# EAGLE design BBB-SPI-ADC-GPS-Cape (EAGLE 7.6.0)
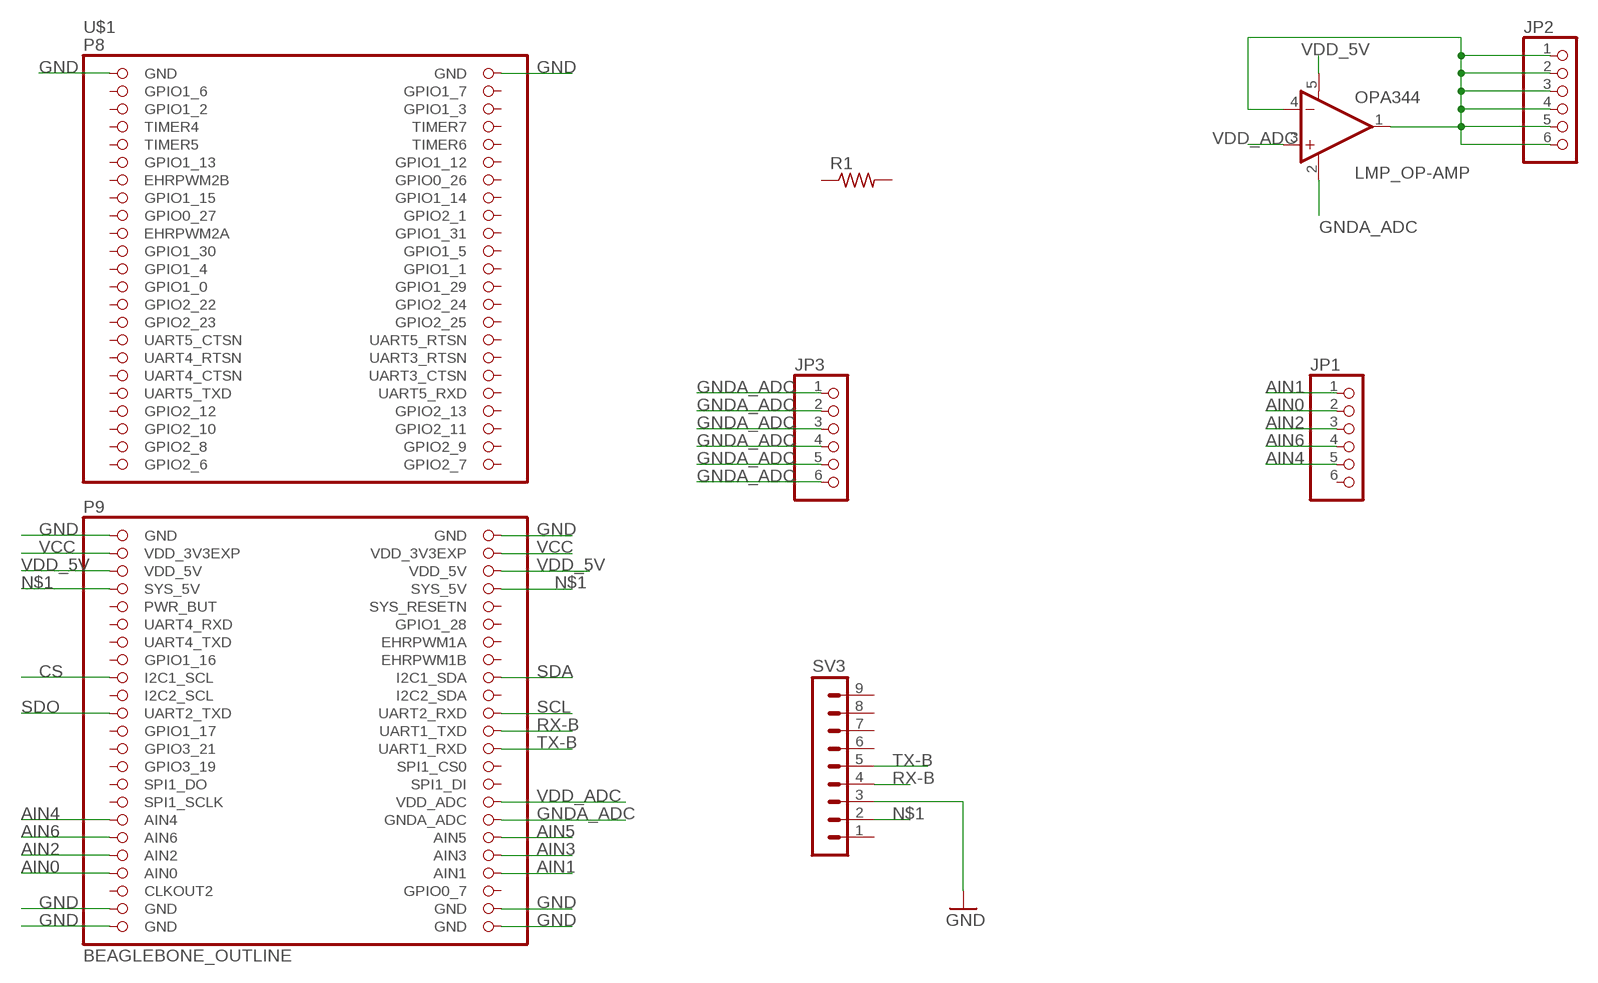
[diagram p0: schematic, sheet 1]

## Parts
JP1  PINHD-1X6  [1X06]
JP2  PINHD-1X6  [1X06]
JP3  PINHD-1X6  [1X06]
LMP_OP-AMP  OPA344  [SOT23-5]
R1  RES-US1206FAB  [R1206FAB]
SV3  MA09-1  [MA09-1]
U$1  BEAGLEBONE_OUTLINE  [BEAGLEBONE_SHIELD]

## Nets
AIN0: JP1.2 U$1.85(AIN0)
AIN1: JP1.1 U$1.86(AIN1)
AIN2: JP1.3 U$1.83(AIN2)
AIN3: U$1.84(AIN3)
AIN4: JP1.5 U$1.79(AIN4)
AIN5: U$1.82(AIN5)
AIN6: JP1.4 U$1.81(AIN6)
CS: U$1.63(I2C1_SCL)
GND: SV3.3 U$1.1(GND) U$1.2(GND) U$1.47(GND) U$1.48(GND) U$1.89(GND) U$1.90(GND) U$1.91(GND) U$1.92(GND)
GNDA_ADC: JP3.1 JP3.2 JP3.3 JP3.4 JP3.5 JP3.6 LMP_OP-AMP.2(V-) U$1.80(GNDA_ADC)
N$1: SV3.2 U$1.53(SYS_5V) U$1.54(SYS_5V)
N$2: JP2.1 JP2.2 JP2.3 JP2.4 JP2.5 JP2.6 LMP_OP-AMP.1(OUT) LMP_OP-AMP.4(-IN)
RX-B: SV3.4 U$1.70(UART1_TXD)
SCL: U$1.68(UART2_RXD)
SDA: U$1.64(I2C1_SDA)
SDO: U$1.67(UART2_TXD)
TX-B: SV3.5 U$1.72(UART1_RXD)
VCC: U$1.49(VDD_3V3EXP) U$1.50(VDD_3V3EXP)
VDD_5V: LMP_OP-AMP.5(V+) U$1.51(VDD_5V) U$1.52(VDD_5V)
VDD_ADC: LMP_OP-AMP.3(+IN) U$1.78(VDD_ADC)
Unconnected: JP1.6 R1.1 R1.2 SV3.1 SV3.6 SV3.7 SV3.8 SV3.9 U$1.3(GPIO1_6) U$1.4(GPIO1_7) U$1.5(GPIO1_2) U$1.6(GPIO1_3) U$1.7(TIMER4) U$1.8(TIMER7) U$1.9(TIMER5) U$1.10(TIMER6) U$1.11(GPIO1_13) U$1.12(GPIO1_12) U$1.13(EHRPWM2B) U$1.14(GPIO0_26) U$1.15(GPIO1_15) U$1.16(GPIO1_14) U$1.17(GPIO0_27) U$1.18(GPIO2_1) U$1.19(EHRPWM2A) U$1.20(GPIO1_31) U$1.21(GPIO1_30) U$1.22(GPIO1_5) U$1.23(GPIO1_4) U$1.24(GPIO1_1) U$1.25(GPIO1_0) U$1.26(GPIO1_29) U$1.27(GPIO2_22) U$1.28(GPIO2_24) U$1.29(GPIO2_23) U$1.30(GPIO2_25) U$1.31(UART5_CTSN) U$1.32(UART5_RTSN) U$1.33(UART4_RTSN) U$1.34(UART3_RTSN) U$1.35(UART4_CTSN) U$1.36(UART3_CTSN) U$1.37(UART5_TXD) U$1.38(UART5_RXD) U$1.39(GPIO2_12) U$1.40(GPIO2_13) U$1.41(GPIO2_10) U$1.42(GPIO2_11) U$1.43(GPIO2_8) U$1.44(GPIO2_9) U$1.45(GPIO2_6) U$1.46(GPIO2_7) U$1.55(PWR_BUT) U$1.56(SYS_RESETN) U$1.57(UART4_RXD) U$1.58(GPIO1_28) U$1.59(UART4_TXD) U$1.60(EHRPWM1A) U$1.61(GPIO1_16) U$1.62(EHRPWM1B) U$1.65(I2C2_SCL) U$1.66(I2C2_SDA) U$1.69(GPIO1_17) U$1.71(GPIO3_21) U$1.73(GPIO3_19) U$1.74(SPI1_CS0) U$1.75(SPI1_DO) U$1.76(SPI1_DI) U$1.77(SPI1_SCLK) U$1.87(CLKOUT2) U$1.88(GPIO0_7)

## Library data of the parts
JP1-JP3 = adafruit:PINHD-1X6: PIN HEADER
LMP_OP-AMP = SparkFun-AnalogIC:OPA344: Single gate rail-to-rail output op-amp. Inputs extend 300mV past rails.; PROD_ID: IC-08251
R1 = fab:RES-US: Resistor (US Symbol) Variants with postfix FAB are widened to allow the routing of internal traces
SV3 = con-lstb:MA09-1: PIN HEADER; OC_FARNELL: unknown; OC_NEWARK: unknown
U$1 = adafruit:BEAGLEBONE_OUTLINE: Should match A3 pinout - but not completely tested; OC_NEWARK: unknown

## Net classes
0 default: width 0.254 mm

## Board
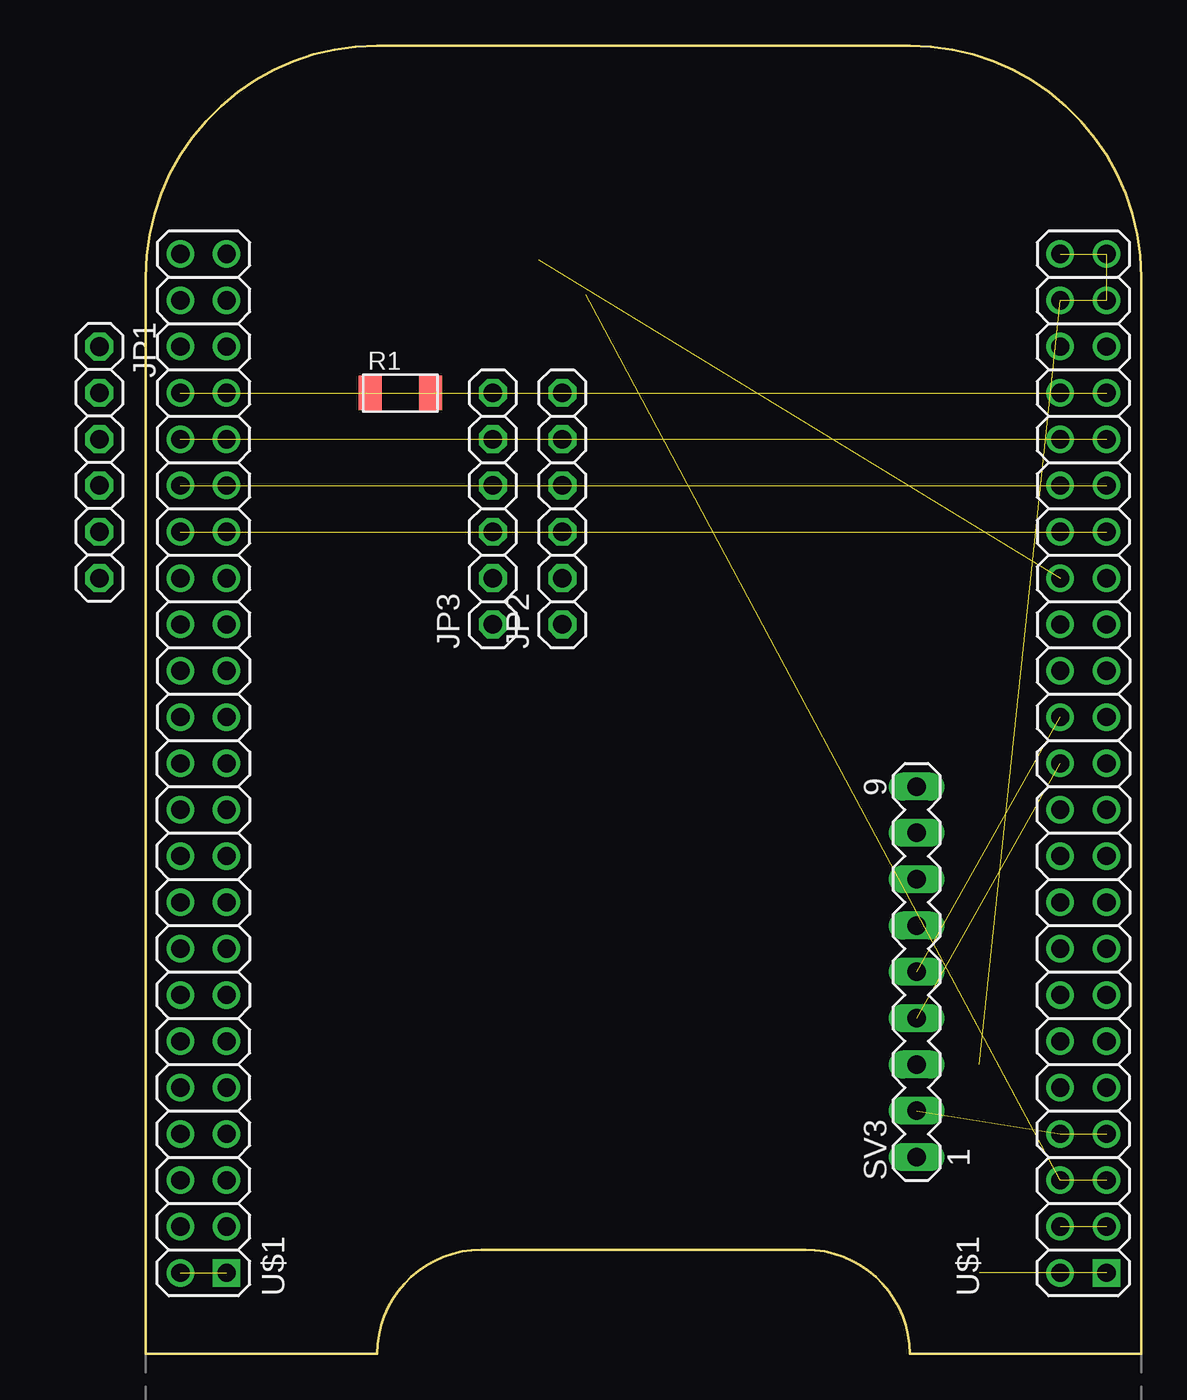
[diagram p1: board, top side]
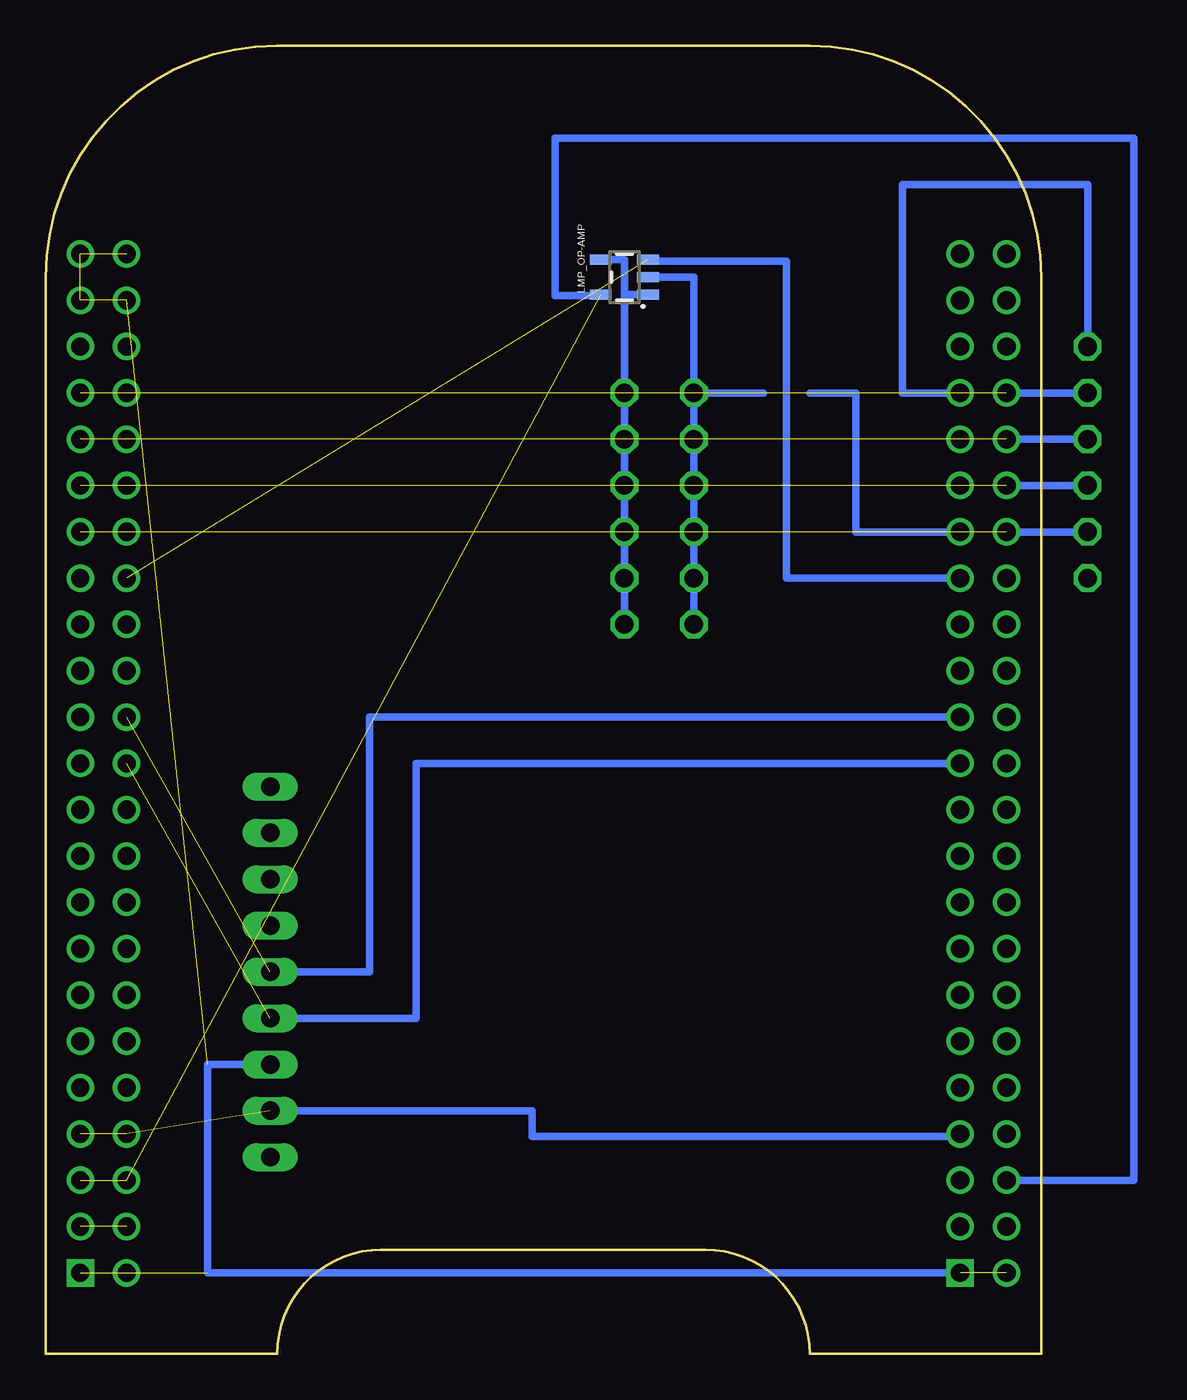
[diagram p2: board, bottom side, seen from below]

Size 54.61 x 71.76 mm. Coordinates in mm from the lower left corner, seen from the top.
Copper layers (1*16): Top 0.035mm / dielectric 1.5mm / Bottom 0.035mm
Design rules "default": minimum track width 10mil, minimum drill 24mil, track to track 8mil, track to pad 8mil, pad to pad 8mil, via to via 8mil, smd to smd 8mil, copper to edge 40mil, drill to drill 8mil, minimum pad ring 10mil, minimum via ring 8mil, stop-mask expansion 4mil, vias tented up to drill 0mil, thermal gap 10mil

### Footprints (pad centres in the part's own frame; a part is rotated, then mirrored left to right if it is on the bottom)
1X06 = drill 1.016 octagon: 1 -6.35,0; 2 -3.81,0; 3 -1.27,0; 4 1.27,0; 5 3.81,0; 6 6.35,0
SOT23-5 = smd 0.55 x 1.2: 1 -0.95,-1.3; 2 0,-1.3; 3 0.95,-1.3; 4 0.95,1.3; 5 -0.95,1.3
R1206FAB = smd 1.27 x 1.905: 1 -1.651,0; 2 1.651,0
MA09-1 = drill 1.016 long: 1 -10.16,0; 2 -7.62,0; 3 -5.08,0; 4 -2.54,0; 5 0,0; 6 2.54,0; 7 5.08,0; 8 7.62,0; 9 10.16,0
BEAGLEBONE_SHIELD = drill 1 square: 1 4.445,19.05; 47 52.705,19.05 | drill 1: 2 1.905,19.05; 3 4.445,21.59; 4 1.905,21.59; 5 4.445,24.13; 6 1.905,24.13; 7 4.445,26.67; 8 1.905,26.67; 9 4.445,29.21; 10 1.905,29.21; 11 4.445,31.75; 12 1.905,31.75; 13 4.445,34.29; 14 1.905,34.29; 15 4.445,36.83; 16 1.905,36.83; 17 4.445,39.37; 18 1.905,39.37; 19 4.445,41.91; 20 1.905,41.91; 21 4.445,44.45; 22 1.905,44.45; 23 4.445,46.99; 24 1.905,46.99; 25 4.445,49.53; 26 1.905,49.53; 27 4.445,52.07; 28 1.905,52.07; 29 4.445,54.61; 30 1.905,54.61; 31 4.445,57.15; 32 1.905,57.15; 33 4.445,59.69; 34 1.905,59.69; 35 4.445,62.23; 36 1.905,62.23; 37 4.445,64.77; 38 1.905,64.77; 39 4.445,67.31; 40 1.905,67.31; 41 4.445,69.85; 42 1.905,69.85; 43 4.445,72.39; 44 1.905,72.39; 45 4.445,74.93; 46 1.905,74.93; 48 50.165,19.05; 49 52.705,21.59; 50 50.165,21.59; 51 52.705,24.13; 52 50.165,24.13; 53 52.705,26.67; 54 50.165,26.67; 55 52.705,29.21; 56 50.165,29.21; 57 52.705,31.75; 58 50.165,31.75; 59 52.705,34.29; 60 50.165,34.29; 61 52.705,36.83; 62 50.165,36.83; 63 52.705,39.37; 64 50.165,39.37; 65 52.705,41.91; 66 50.165,41.91; 67 52.705,44.45; 68 50.165,44.45; 69 52.705,46.99; 70 50.165,46.99; 71 52.705,49.53; 72 50.165,49.53; 73 52.705,52.07; 74 50.165,52.07; 75 52.705,54.61; 76 50.165,54.61; 77 52.705,57.15; 78 50.165,57.15; 79 52.705,59.69; 80 50.165,59.69; 81 52.705,62.23; 82 50.165,62.23; 83 52.705,64.77; 84 50.165,64.77; 85 52.705,67.31; 86 50.165,67.31; 87 52.705,69.85; 88 50.165,69.85; 89 52.705,72.39; 90 50.165,72.39; 91 52.705,74.93; 92 50.165,74.93

### Placement (x,y rotation side)
JP1  -2.54,48.9 270 top
JP2  22.86,46.36 90 top
JP3  19.05,46.36 90 top
LMP_OP-AMP  22.86,59.06 90 bottom
R1  13.97,52.7 0 top
SV3  42.29,20.96 90 top
U$1  0,-14.61 0 top

### Tracks (layer width: path | path; a pad name or v marks a point on that pad's centre or on a via)
AIN0  (1 unrouted)
  Bottom 0.406: JP1.2 1.91,52.7
AIN1  (1 unrouted)
  Bottom 0.406: JP1.1 -2.54,64.14 7.62,64.14 7.62,52.7 4.45,52.7
AIN2  (1 unrouted)
  Bottom 0.406: JP1.3 1.91,50.17
AIN4  (1 unrouted)
  Bottom 0.406: JP1.5 1.91,45.08
AIN6  (1 unrouted)
  Bottom 0.406: JP1.4 1.91,47.62
GND  (7 unrouted)
  Bottom 0.406: U$1.1 45.72,4.45 45.72,15.88 SV3.3
GNDA_ADC  (1 unrouted)
  Bottom 0.406: JP3.1 JP3.2 JP3.3 JP3.4 JP3.5 JP3.6 | LMP_OP-AMP.2 19.05,59.06 JP3.6 | JP3.6 15.24,52.7
N$1  (2 unrouted)
  Bottom 0.406: 4.57,11.94 27.94,11.94 27.94,13.34 SV3.2
N$2
  Bottom 0.406: JP2.1 JP2.2 JP2.3 JP2.4 JP2.5 JP2.6 22.86,58.11 | LMP_OP-AMP.4 22.86,60.01 22.86,58.11 | LMP_OP-AMP.1 22.86,58.11
N$3
  Bottom 0.406: 4.45,32.39 34.29,32.39 34.29,18.42 42.16,18.42
N$4
  Bottom 0.406: 4.45,34.92 36.83,34.92 36.83,20.96 42.16,20.96
N$5
  Bottom 0.406: 21.59,59.94 13.97,59.94 13.97,42.55 4.45,42.55
N$6
  Bottom 0.406: 12.7,52.7 10.16,52.7 10.16,45.08 4.45,45.08
N$7
  Bottom 0.406: 24.13,58.04 26.67,58.04 26.67,66.67 -5.08,66.67 -5.08,9.53 1.91,9.53
RX-B  (1 unrouted)
TX-B  (1 unrouted)
VCC  (1 unrouted)
VDD_5V  (2 unrouted)
VDD_ADC  (1 unrouted)